# EAGLE design picoAva-Rev3 (EAGLE 6.2)
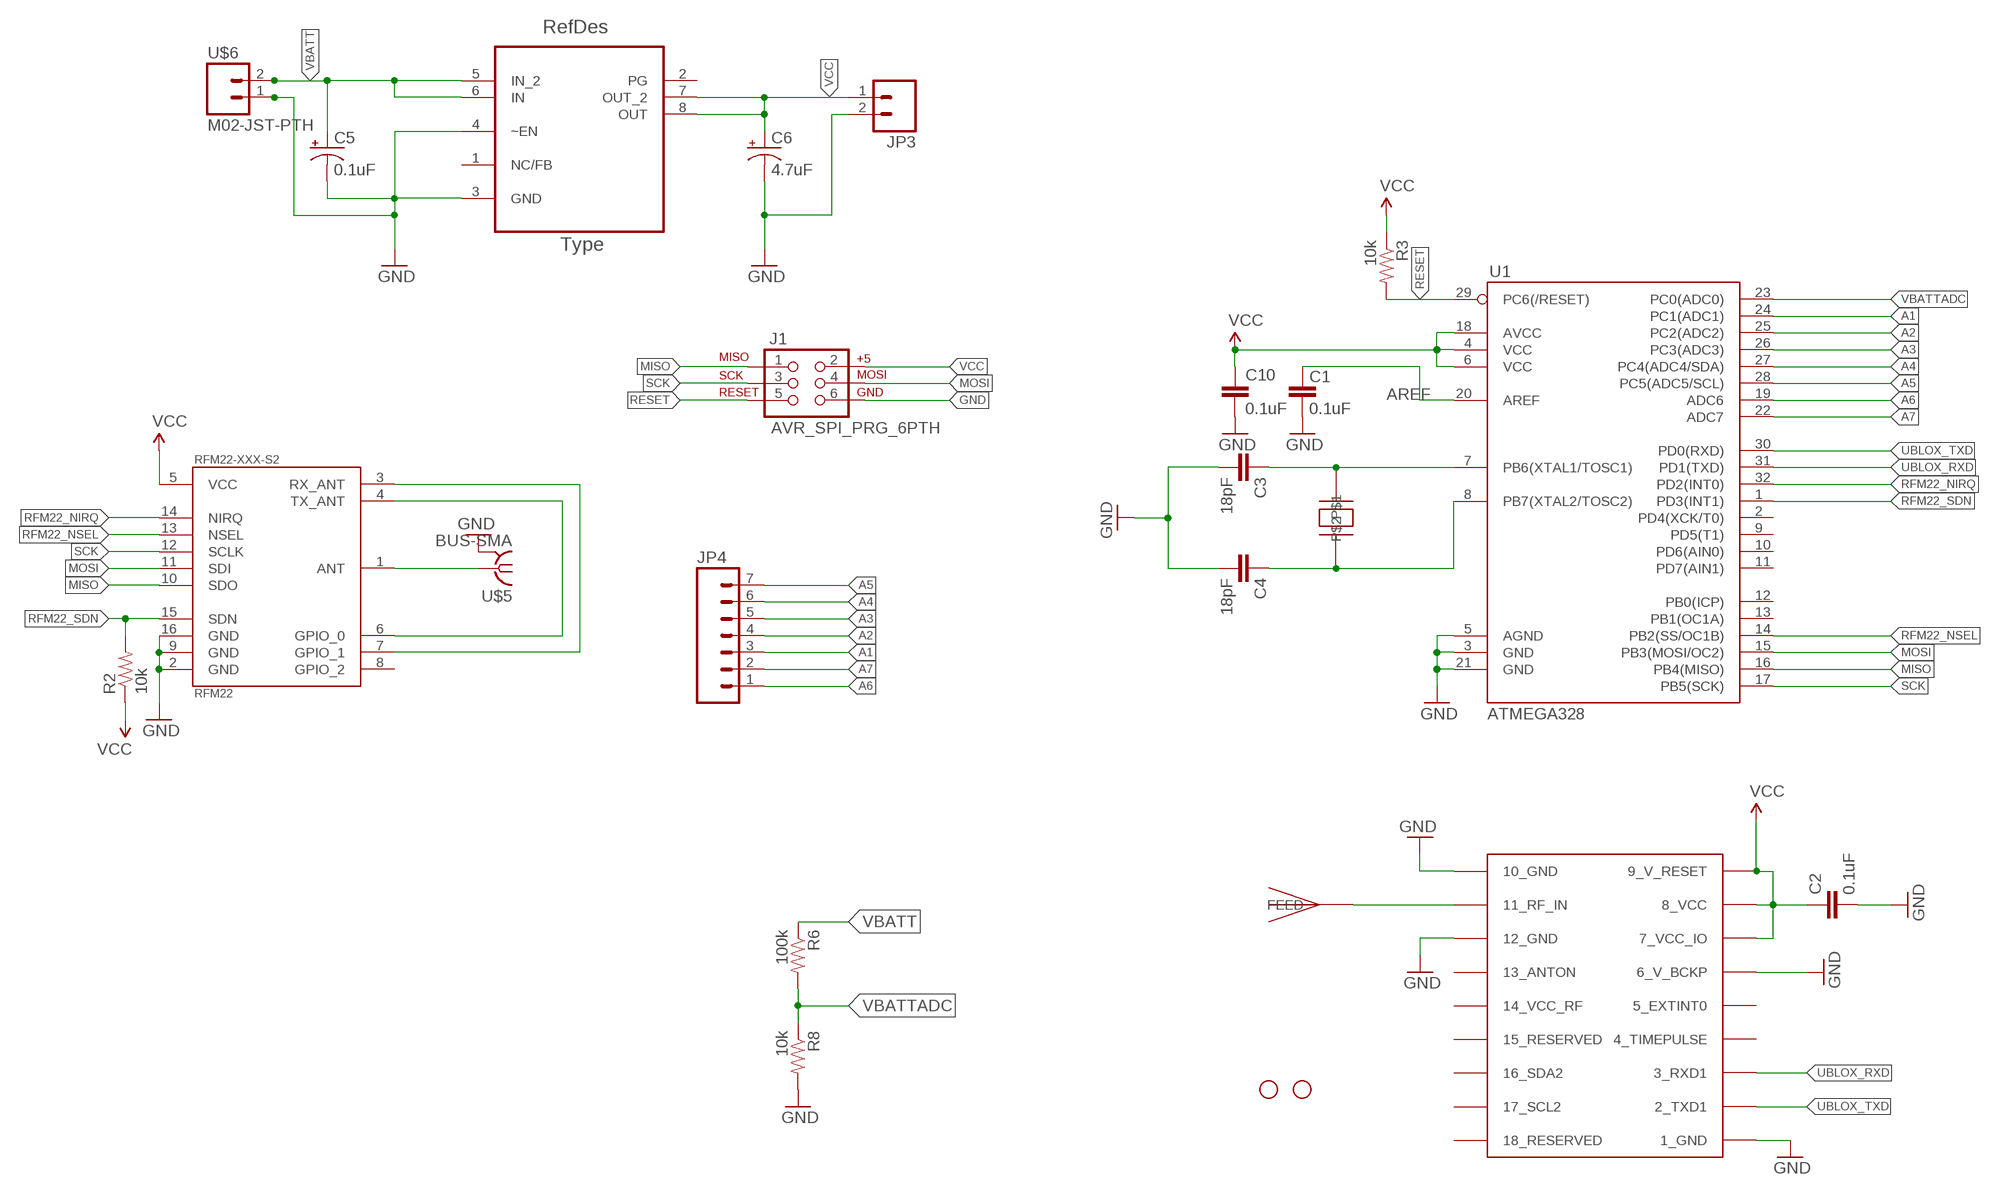
[diagram p0: schematic, sheet 1]

## Parts
C1  0.1uF  CAP0402-CAP  [0402-CAP]
C2  0.1uF  CAP0402-CAP  [0402-CAP]
C3  18pF  CAP0402-CAP  [0402-CAP]
C4  18pF  CAP0402-CAP  [0402-CAP]
C5  0.1uF  CAP_POL1206-KIT  [EIA3216-KIT]
C6  4.7uF  CAP_POL1206-KIT  [EIA3216-KIT]
C10  0.1uF  CAP0402-CAP  [0402-CAP]
J1  AVR_SPI_PRG_6PTH  [2X3]
JP1  STAND-OFF  [STAND-OFF]
JP2  STAND-OFF  [STAND-OFF]
JP3  M02PTH  [1X02]
JP4  M07  [1X07]
R2  10k  RESISTOR0402-RES  [0402-RES]
R3  10k  RESISTOR0402-RES  [0402-RES]
R6  100k  RESISTOR0402-RES  [0402-RES]
R8  10k  RESISTOR0402-RES  [0402-RES]
RFM22-XXX-S2  RFM22  [RFM22-XXX-S2]
U1  ATMEGA328  ATMEGA168  [TQFP32-08]
U2  TPS76633D  [SOIC127P600X175-8N]
U$1  UBLOX_MAX-6  [UBLOX_MAX-6]
U$2  ABRACON_ABM3_CRYSTAL  [ABRACON_ABM3_CRYSTAL]
U$3  JTI_ANTENNA-1575AT43A40  [JTI_ANTENNA-1575AT43A40]
U$5  BUS-SMA  [BUS-SMA]
U$6  M02-JST-PTH  [M02-JST-PTH]

## Nets
A1: JP4.3 U1.24(PC1(ADC1))
A2: JP4.4 U1.25(PC2(ADC2))
A3: JP4.5 U1.26(PC3(ADC3))
A4: JP4.6 U1.27(PC4(ADC4/SDA))
A5: JP4.7 U1.28(PC5(ADC5/SCL))
A6: JP4.1 U1.19(ADC6)
A7: JP4.2 U1.22(ADC7)
AREF: C1.2 U1.20(AREF)
GND [vcc]: C1.1 C2.2 C3.2 C4.2 C5.C(-) C6.C(-) C10.2 J1.6 JP3.2 R8.2 RFM22-XXX-S2.2(GND) RFM22-XXX-S2.9(GND) RFM22-XXX-S2.16(GND) U1.3(GND) U1.5(AGND) U1.21(GND) U2.3(GND) U2.4(~EN) U$1.1_GND U$1.6_V_BCKP U$1.10_GND U$1.12_GND U$5.2(GND) U$5.3(GND) U$5.4(GND) U$5.5(GND) U$6.1
MISO: J1.1 RFM22-XXX-S2.10(SDO) U1.16(PB4(MISO))
MOSI: J1.4 RFM22-XXX-S2.11(SDI) U1.15(PB3(MOSI/OC2))
N$3: RFM22-XXX-S2.1(ANT) U$5.1
N$4: U$1.11_RF_IN U$3.FEED
N$5: RFM22-XXX-S2.3(RX_ANT) RFM22-XXX-S2.7(GPIO_1)
N$6: RFM22-XXX-S2.4(TX_ANT) RFM22-XXX-S2.6(GPIO_0)
N$9: C3.1 U1.7(PB6(XTAL1/TOSC1)) U$2.P$2
N$10: C4.1 U1.8(PB7(XTAL2/TOSC2)) U$2.P$1
RESET: J1.5 R3.2 U1.29(PC6(/RESET))
RFM22_NIRQ: RFM22-XXX-S2.14(NIRQ) U1.32(PD2(INT0))
RFM22_NSEL: RFM22-XXX-S2.13(NSEL) U1.14(PB2(SS/OC1B))
RFM22_SDN: R2.2 RFM22-XXX-S2.15(SDN) U1.1(PD3(INT1))
SCK: J1.3 RFM22-XXX-S2.12(SCLK) U1.17(PB5(SCK))
UBLOX_RXD: U1.31(PD1(TXD)) U$1.3_RXD1
UBLOX_TXD: U1.30(PD0(RXD)) U$1.2_TXD1
VBATT [vcc]: C5.A(+) R6.1 U2.5(IN_2) U2.6(IN) U$6.2
VBATTADC: R6.2 R8.1 U1.23(PC0(ADC0))
VCC: C2.1 C6.A(+) C10.1 J1.2 JP3.1 R2.1 R3.1 RFM22-XXX-S2.5(VCC) U1.4(VCC) U1.6(VCC) U1.18(AVCC) U2.7(OUT_2) U2.8(OUT) U$1.7_VCC_IO U$1.8_VCC U$1.9_V_RESET
Unconnected: RFM22-XXX-S2.8(GPIO_2) U1.2(PD4(XCK/T0)) U1.9(PD5(T1)) U1.10(PD6(AIN0)) U1.11(PD7(AIN1)) U1.12(PB0(ICP)) U1.13(PB1(OC1A)) U2.1(NC/FB) U2.2(PG) U$1.4_TIMEPULSE U$1.5_EXTINT0 U$1.13_ANTON U$1.14_VCC_RF U$1.15_RESERVED U$1.16_SDA2 U$1.17_SCL2 U$1.18_RESERVED

## Library data of the parts
C1-C4 C10 = SparkFun:CAP: Capacitor Standard 0603 ceramic capacitor, and 0.1" leaded capacitor.
C5 C6 = SparkFun:CAP_POL: Capacitor Polarized These are standard SMD and PTH capacitors. Normally 10uF, 47uF, and 100uF in electrolytic and tantalum varieties. Always verify the external diameter of the through hole cap, it varies with capacity, voltage, and manufacturer. The EIA devices should be standard.
J1 = SparkFun:AVR_SPI_PRG_6: AVR ISP 6 Pin This is the reduced ISP connector for AVR programming. Common on Arduino. This footprint will take up less PCB space and can be used with a 10-pin to 6-pin adapter such as SKU: BOB-08508
JP1 JP2 = SparkFun:STAND-OFF: Stand Off This is the mechanical footprint for a #4 phillips button head screw. Use the keepout ring to avoid running the screw head into surrounding components. SKU : PRT-00447
JP3 = SparkFun:M02: Header 2 Standard 2-pin 0.1" header. Use with straight break away headers (SKU : PRT-00116), right angle break away headers (PRT-00553), swiss pins (PRT-00743), machine pins (PRT-00117), and female headers (PRT-00115). Molex polarized connector foot print use with SKU : PRT-08233 with associated crimp pins and housings.
JP4 = SparkFun:M07: Header 7 Standard 7-pin 0.1" header. Use with straight break away headers (SKU : PRT-00116), right angle break away headers (PRT-00553), swiss pins (PRT-00743), machine pins (PRT-00117), and female headers (PRT-00115). NOTES ON THE VARIANTS LOCK and LOCK_LONGPADS... This footprint was designed to help hold the alignment of a through-hole component (i.e. 7-pin header) while soldering it into place. You may notice that each hole has been shifted either up or down by 0.005 of an inch from it's more standard position (which is usually a perfectly straight line). This slight alteration caused the pins (the squares in the middle) to touch the edges of the holes. Because they are alternating, it causes a "brace" to hold the header in place. 0.005 has proven to be the perfect amount of "off-center" position when using our standard breakaway headers. Although looks a little odd when you look at the bare footprint, once you have a header in there, the alteration is very hard to notice. Also, if you push a header all the way into place, it is covered up entirely on the bottom side. This idea of altering the position of holes to aid alignment will be further integrated into the Sparkfun Library for other footprints. It can help hold any component with 3 or more connection pins.
R2 R3 R6 R8 = SparkFun:RESISTOR: Resistor Basic schematic elements and footprints for 0603, 1206, and PTH resistors.
RFM22-XXX-S2 = SparkFun:RFM22: *Hope RF's RFM22* Packages: RFM22-S2 (SMD)
U1 = SparkFun:ATMEGA168
U2 = ava:TPS76633D; DESCRIPTION: ULTRALOW QUIESCENT CURRENT 250-mA LOW DROPOUT VOLTAGE REGULATORS; MPN: TPS76633D; OC_FARNELL: 8461422; OC_NEWARK: 77C1060; PACKAGE: SOIC-8; SUPPLIER: Texas Instruments
U$1 = ava:UBLOX_MAX-6: UBLOX MAX-6
U$2 = ava:ABRACON_ABM3_CRYSTAL
U$3 = ava:JTI_ANTENNA-1575AT43A40
U$5 = ava:BUS-SMA
U$6 = ava:M02-JST-PTH

## Net classes
0 default: width 0.203 mm
1 vcc: width 0.254 mm

## Board
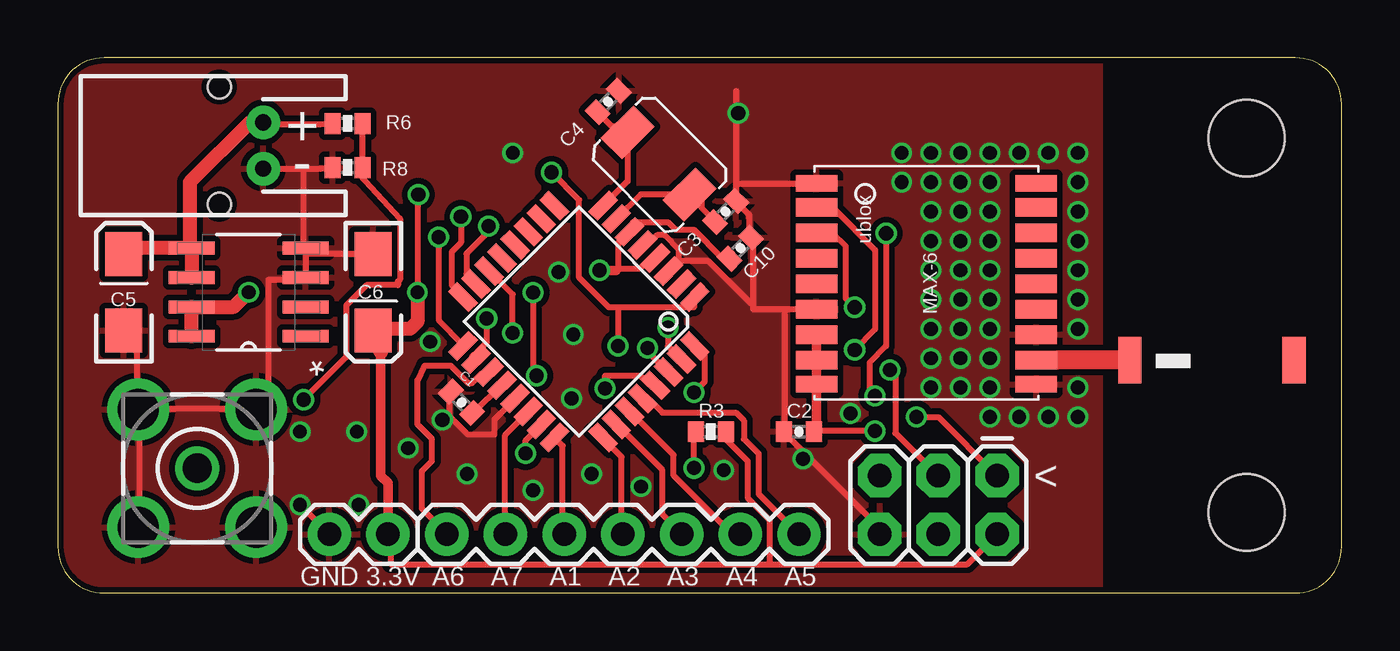
[diagram p1: board, top side]
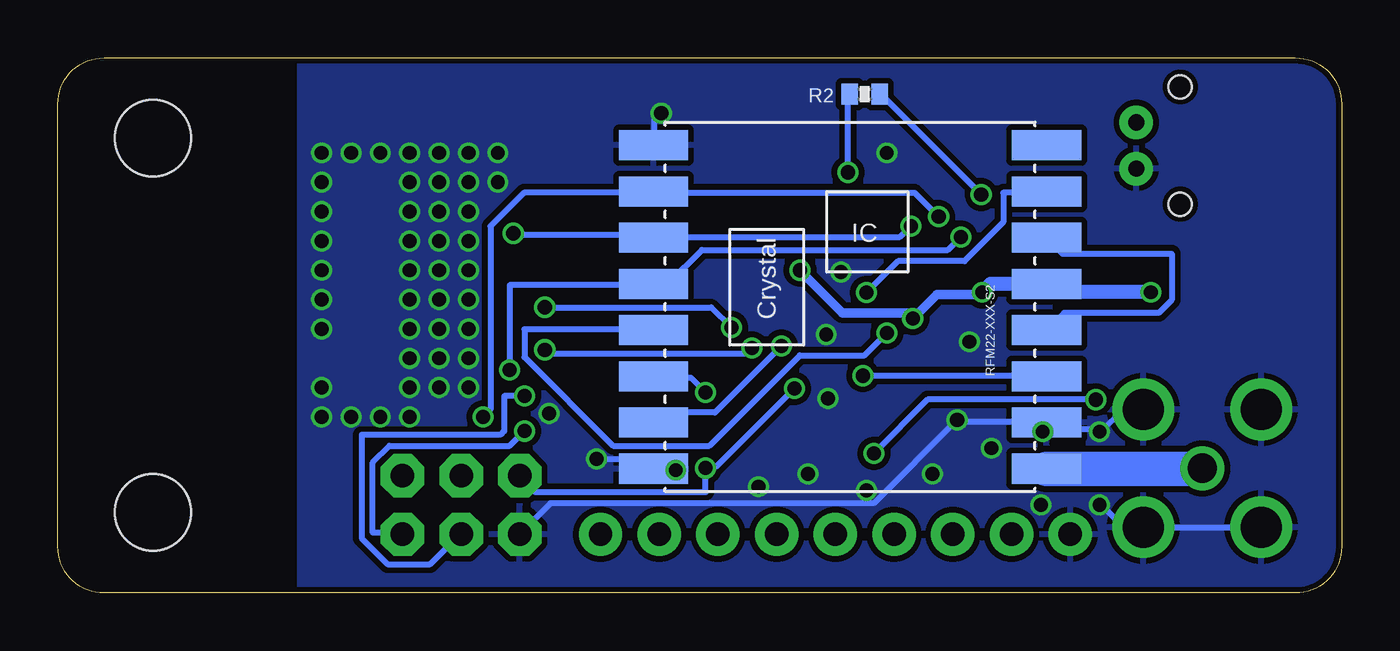
[diagram p2: board, bottom side, seen from below]

Size 55.55 x 23.17 mm. Coordinates in mm from the lower left corner, seen from the top.
Outline: 0,21.17 0,2 arc90 2,0 53.55,0 arc90 55.55,2 55.55,21.17 arc90 53.55,23.17 2,23.17 arc90 0,21.17
Copper layers (1*16): Top 0.035mm / dielectric 1.5mm / Bottom 0.035mm
Design rules: minimum track width 6mil, minimum drill 12mil, track to track 6mil, track to pad 6mil, pad to pad 6mil, via to via 6mil, smd to smd 0mil, copper to edge 10mil, drill to drill 10mil, minimum pad ring 10mil, minimum via ring 6mil, stop-mask expansion 2mil, vias tented up to drill 100mil, thermal gap 10mil

### Footprints (pad centres in the part's own frame; a part is rotated, then mirrored left to right if it is on the bottom)
0402-CAP = smd 0.7 x 0.9: 1 -0.65,0; 2 0.65,0
EIA3216-KIT = smd 1.9 x 1.6: A 1.65,0; C -1.65,0
2X3 = drill 1.016 pad 1.88 octagon: 1 0,0; 2 0,2.54; 3 2.54,0; 4 2.54,2.54; 5 5.08,0; 6 5.08,2.54
STAND-OFF = hole 3.302: 0,0
1X02 = drill 1.016 pad 1.88: 1 0,0; 2 2.54,0
1X07 = drill 1.016 pad 1.88: 1 0,0; 2 2.54,0; 3 5.08,0; 4 7.62,0; 5 10.16,0; 6 12.7,0; 7 15.24,0
0402-RES = smd 0.7 x 0.9: 1 -0.65,0; 2 0.65,0
RFM22-XXX-S2 = smd 3 x 1.3: 1 -8.5,7; 2 -8.5,5; 3 -8.5,3; 4 -8.5,1; 5 -8.5,-1; 6 -8.5,-3; 7 -8.5,-5; 8 -8.5,-7; 9 8.5,-7; 10 8.5,-5; 11 8.5,-3; 12 8.5,-1; 13 8.5,1; 14 8.5,3; 15 8.5,5; 16 8.5,7
TQFP32-08 = smd 1.27 x 0.559: 1 -4.293,2.8; 2 -4.293,2; 3 -4.293,1.2; 4 -4.293,0.4; 5 -4.293,-0.4; 6 -4.293,-1.2; 7 -4.293,-2; 8 -4.293,-2.8; 17 4.293,-2.8; 18 4.293,-2; 19 4.293,-1.2; 20 4.293,-0.4; 21 4.293,0.4; 22 4.293,1.2; 23 4.293,2; 24 4.293,2.8 | smd 0.559 x 1.27: 9 -2.8,-4.293; 10 -2,-4.293; 11 -1.2,-4.293; 12 -0.4,-4.293; 13 0.4,-4.293; 14 1.2,-4.293; 15 2,-4.293; 16 2.8,-4.293; 25 2.8,4.293; 26 2,4.293; 27 1.2,4.293; 28 0.4,4.293; 29 -0.4,4.293; 30 -1.2,4.293; 31 -2,4.293; 32 -2.8,4.293
SOIC127P600X175-8N = smd 1.981 x 0.559: 1 -2.464,1.905; 2 -2.464,0.635; 3 -2.464,-0.635; 4 -2.464,-1.905; 5 2.464,-1.905; 6 2.464,-0.635; 7 2.464,0.635; 8 2.464,1.905
UBLOX_MAX-6 = smd 1.8 x 0.7: 1_GND 4.95,-4.4; 9_V_RESET 4.95,4.3; 10_GND -4.55,4.3; 18_RESERVED -4.55,-4.4 | smd 1.8 x 0.8: 2_TXD1 4.95,-3.35; 3_RXD1 4.95,-2.25; 4_TIMEPULSE 4.95,-1.15; 5_EXTINT0 4.95,-0.05; 6_V_BCKP 4.95,1.05; 7_VCC_IO 4.95,2.15; 8_VCC 4.95,3.25; 11_RF_IN -4.55,3.25; 12_GND -4.55,2.15; 13_ANTON -4.55,1.05; 14_VCC_RF -4.55,-0.05; 15_RESERVED -4.55,-1.15; 16_SDA2 -4.55,-2.25; 17_SCL2 -4.55,-3.35
ABRACON_ABM3_CRYSTAL = smd 1.3 x 2: P$1 -3.4,0.1; P$2 0.4,0.1
JTI_ANTENNA-1575AT43A40 = smd 1 x 2: FEED -3.81,-1.27; NC 3.29,-1.27
BUS-SMA = drill 1.27: 1 0,0 | drill 1.778: 2 -2.55,2.55; 3 2.55,2.55; 4 2.55,-2.55; 5 -2.55,-2.55
M02-JST-PTH = drill 0.7 pad 1.448: 1 -1,0; 2 1,0 | hole 1: -2.54,1.905; 2.54,1.905

### Placement (x,y rotation side)
C1  17.46,8.26 315 top
C2  32.07,6.98 180 top
C3  28.89,16.51 45 top
C4  23.81,21.27 45 top
C5  2.86,13.02 90 top
C6  13.65,13.02 270 top
C10  29.53,14.92 45 top
J1  40.64,5.08 180 top
JP1  51.44,19.68 0 top
JP2  51.44,3.49 0 top
JP3  14.29,2.54 180 top
JP4  16.83,2.54 0 top
R2  20.64,21.59 180 bottom
R3  28.26,6.98 180 top
R6  12.54,20.32 0 top
R8  12.54,18.41 180 top
RFM22-XXX-S2  21.27,12.38 180 bottom
U1  22.54,11.75 225 top
U2  8.26,13.02 180 top
U$1  37.78,13.34 180 top
U$2  26.99,17.46 315 top
U$3  50.2,11.35 0 top
U$5  6.03,5.4 0 top
U$6  8.89,19.37 90 top

### Tracks (layer width: path | path; a pad name or v marks a point on that pad's centre or on a via)
A1
  Top 0.254: U1.24 21.52,6.69 21.84,6.37 21.84,2.61 JP4.3
A2
  Top 0.254: U1.25 23.6,6.69 24.4,5.89 24.4,2.61 JP4.4
A3
  Top 0.254: U1.26 24.24,7.25 26.16,5.33 26.16,3.41 26.96,2.61 JP4.5
A4
  Top 0.254: U1.27 24.8,7.81 26.64,5.97 26.64,5.09 29.12,2.61 29.52,2.61 JP4.6
A5
  Top 0.254: JP4.7 30.32,4.29 30.32,6.03 29.69,6.67 29.69,7.46 29.34,7.81 26.16,7.81 25.6,8.37 25.36,8.37 U1.28
A6
  Top 0.254: U1.19 18.64,9.49 18.32,9.49 17.92,9.09 17.76,9.09 17,9.84 15.88,9.84 15.56,9.21 15.56,7.3 16.19,6.67 16.19,5.71 15.76,5.28 15.76,3.65 16.8,2.61 JP4.1
A7
  Top 0.254: U1.22 20.32,7.81 19.36,6.85 19.36,2.61 JP4.2
AREF
  Top 0.254: C1.2 18,7.81 19.2,9.01 U1.20
GND  (via drill 0.6, 0.61)
  Top 0.254: 32.4,5.97 35.52,2.85 35.52,2.61 J1.6 | 32.4,5.97 31.44,6.93 C2.2 31.44,7.09 31.44,12.29 | v32.24,5.81 32.4,5.97 | 26.88,14.37 26.88,14.85 26.24,15.49 25.92,15.49 25.52,15.09 25.36,15.09 U1.5 | 26.88,14.37 26.48,13.97 U1.3 | 29.36,17.73 29.36,17.09 C3.2 29.36,16.93 29.92,16.37 29.92,15.41 C10.2 30.08,15.33 30.08,12.53 | 29.36,17.73 29.36,20.77 | 29.36,20.77 29.36,21.73 | 31.44,12.29 30.08,12.29 30.08,12.53 | 31.44,12.29 32.8,12.29 U$1.6_V_BCKP | 29.36,17.73 32.8,17.73 U$1.1_GND | 26.88,14.37 28.16,14.37 30,12.53 30.08,12.53 | v29.44,20.77 29.36,20.77 | JP3.2 v10.48,3.81 | C5.C 2.88,11.33 3.44,10.77 3.44,7.97 U$5.2 | U$6.1 10.64,18.37 | 10.64,18.37 11.36,18.37 R8.2 | 10.72,14.69 13.6,14.69 C6.C | 10.72,14.69 10.72,14.85 U2.4 10.64,15.01 10.64,18.37 | 10.72,14.69 10.72,13.73 U2.3 10.64,13.57 9.12,13.57 9.12,8.45 8.64,7.97 U$5.3 8.48,7.97 3.6,7.97 U$5.2 | 16.96,7.65 16.96,8.69 C1.1 | 16.96,7.65 17.76,6.85 18.88,6.85 18.88,7.49 19.76,8.37 U1.21 | v16.64,7.49 16.64,7.57 16.88,7.57 16.96,7.65 | U$5.5 3.52,2.93 3.52,7.89 U$5.2
  Bottom 0.254: v32.24,5.81 30.24,5.81 29.84,5.41 RFM22-XXX-S2.16 | v29.44,20.77 29.76,20.77 29.76,19.41 RFM22-XXX-S2.9 | v10.48,3.81 10.4,3.81 9.52,2.93 8.64,2.93 U$5.4 8.48,2.85 3.52,2.85 U$5.5 | U$5.3 8.64,7.89 9.52,7.89 10.4,7.01 v10.48,6.99 10.56,7.09 12.48,7.09 12.72,7.33 RFM22-XXX-S2.2 12.8,7.41 16.56,7.41 v16.64,7.49 20.24,3.89 34.24,3.89 35.52,2.61 J1.6
  other vias: 44.13,11.43 44.13,8.89 19.68,19.05 22.23,8.41 20.56,4.45 25.24,4.6 28.81,5.32 13.02,3.81 12.94,6.98 22.3,11.19 16.11,10.87 15.16,6.27 17.7,5.16 40.32,8.89 37.78,8.89 39.05,8.89 40.32,10.16 39.05,10.16 37.78,10.16 40.32,11.43 37.78,11.43 39.05,11.43 40.32,12.7 39.05,12.7 37.78,12.7 40.32,13.97 37.78,13.97 39.05,13.97 40.32,15.24 39.05,15.24 37.78,15.24 40.32,16.51 37.78,16.51 39.05,16.51 40.32,17.78 39.05,17.78 37.78,17.78 36.51,17.78 44.13,12.7 44.13,13.97 44.13,15.24 44.13,16.51 44.13,17.78 44.13,19.05 42.86,19.05 41.59,19.05 40.32,19.05 39.05,19.05 37.78,19.05 36.51,19.05 40.32,7.62 41.59,7.62 42.86,7.62 44.13,7.62 23.1,5.16 21.67,13.89 34.29,7.78
  pour Top (isolate 0.254): 0,23.18 45.09,23.18 45.09,0 2,0 arc-90 0,2
  pour Bottom (isolate 0.254): 0,23.18 45.09,23.18 45.09,0 2,0 arc-90 0,2
MISO  (via drill 0.6, 0.61)
  Top 0.254: v17.44,16.29 17.44,15.17 17.04,14.77 17.04,13.33 17.52,12.85 U1.16 | v37.15,7.62 38.1,7.62 J1.1
  Bottom 0.254: v17.44,16.29 18.48,17.33 29.76,17.33 | 29.76,17.33 RFM22-XXX-S2.10 | 29.76,17.33 35.38,17.33 36.83,15.87 36.83,7.94 v37.15,7.62
MOSI  (via drill 0.61)
  Top 0.254: v18.64,15.89 18.64,15.65 17.68,14.69 17.68,13.81 18.08,13.41 U1.15 | v35.36,8.53 35.12,8.77 35.12,9.97 35.84,10.69 v35.84,15.57
  Bottom 0.254: v18.64,15.89 19.12,15.41 29.76,15.41 RFM22-XXX-S2.11 29.84,15.49 35.76,15.49 v35.84,15.57 | v35.36,8.53 36.24,8.53 36.24,7.01 36.4,6.85 42.4,6.85 42.4,2.37 41.28,1.25 39.44,1.25 38.16,2.53 J1.4
N$3
  Bottom 0.813: 6.03,5.38 U$5.1
  Bottom 1.5: RFM22-XXX-S2.1 6.03,5.38
N$4
  Top 0.254: 43.21,10.08 42.97,10.08 U$1.11_RF_IN
  Top 0.813: U$3.FEED 43.21,10.08
N$5  (via drill 0.61)
  Top 0.254: v20.72,9.41 20.56,9.57 v20.56,13.01
  Bottom 0.254: v20.72,9.41 12.8,9.41 RFM22-XXX-S2.3 | v20.56,13.01 19.2,14.37 16.32,14.37 14.64,16.05 14.64,17.33 12.8,17.33 RFM22-XXX-S2.7
N$6
  Bottom 0.254: RFM22-XXX-S2.4 12.72,11.41 12,12.13 7.92,12.13 7.36,12.69 7.36,14.69 12.08,14.69 12.72,15.33 RFM22-XXX-S2.6
N$9
  Top 0.254: U$2.P$2 25.22,17.25 U1.7 | U$2.P$2 27.8,17.25 | C3.1 28.4,16.13 27.84,16.69 27.84,17.17 U$2.P$2
N$10
  Top 0.254: U$2.P$1 24.65,17.82 U1.8 | 24.56,19.57 U$2.P$1 | U$2.P$1 24.41,20.18 23.99,20.18 C4.1
RESET  (via drill 0.61)
  Top 0.254: v27.52,5.41 27.52,6.85 27.6,6.93 R3.2 | v23.68,8.85 23.68,9.41 25.2,9.41 25.6,9.01 25.84,9.01 U1.29
  Bottom 0.254: J1.5 35.52,5.01 34.88,4.37 27.52,4.37 v27.52,5.41 27.44,5.49 27.04,5.49 v23.68,8.85
RFM22_NIRQ  (via drill 0.61)
  Top 0.254: v27.52,8.69 28,9.17 28,10.29 27.6,10.69 U1.32
  Bottom 0.254: v27.52,8.69 28.16,9.33 29.76,9.33 RFM22-XXX-S2.14
RFM22_NSEL  (via drill 0.61)
  Top 0.254: v19.68,11.25 19.68,12.93 18.72,13.89 U1.14
  Bottom 0.254: v19.68,11.25 20.64,10.29 23.44,10.29 27.36,6.37 31.52,6.37 35.36,10.21 35.36,11.41 29.84,11.41 RFM22-XXX-S2.13
RFM22_SDN  (via drill 0.61)
  Top 0.254: v21.36,18.21 22.56,17.01 22.56,13.65 23.84,12.37 24.24,12.37 | 24.24,12.37 27.52,12.37 27.52,12.77 U1.1 | 24.24,12.37 v24.24,10.69
  Bottom 0.254: v21.36,18.21 21.36,21.57 R2.2 | v24.24,10.69 27.12,7.81 29.36,7.81 29.76,7.41 RFM22-XXX-S2.15
SCK  (via drill 0.61)
  Top 0.254: v16.48,15.41 16.48,11.81 17.52,10.77 U1.17 | v36,9.65 36.24,9.41 36.24,6.93 38.08,5.09 J1.3
  Bottom 0.254: v16.48,15.41 17.04,14.85 27.68,14.85 29.12,13.41 29.76,13.41 RFM22-XXX-S2.12 29.84,13.33 36,13.33 v36,9.65
UBLOX_RXD  (via drill 0.61)
  Top 0.254: v26.4,11.49 26.4,10.69 26.96,10.13 U1.31 | v34.48,12.37 34.08,12.77 34.08,15.01 33.52,15.57 32.88,15.57 U$1.3_RXD1
  Bottom 0.254: v26.4,11.49 27.28,12.37 v34.48,12.37
UBLOX_TXD  (via drill 0.61)
  Top 0.254: v25.52,10.61 25.52,10.45 26.4,9.57 U1.30 | v34.48,10.53 35.36,11.41 35.36,14.85 33.6,16.61 32.88,16.61 U$1.2_TXD1
  Bottom 0.254: v25.52,10.61 25.76,10.37 34.32,10.37 v34.48,10.53
VBATT
  Top 0.254: R6.1 11.36,20.29 9.12,20.29 U$6.2
  Top 0.61: U$6.2 8.3,20.37 5.71,17.78 5.71,15 U2.5 | U2.5 U2.6 | U2.5 3.11,14.92 C5.A
VBATTADC  (via drill 0.61)
  Top 0.254: v20.24,6.05 20.24,6.61 20.88,7.25 U1.23 | v10.64,8.37 12.48,10.21 12.48,12.45 13.36,13.33 14.72,13.33 14.72,13.49 14.8,13.57 14.8,16.21 13.04,18.13 R8.1 R6.2
  Bottom 0.254: v20.24,6.05 17.92,8.37 v10.64,8.37
VCC  (via drill 0.6, 0.61)
  Top 0.254: v35.36,7.01 32.96,7.01 C2.1 | C10.1 29.04,14.53 28.72,14.53 27.52,15.73 26.72,15.73 26.4,16.05 24.88,16.05 24.88,15.73 24.8,15.65 U1.6 24.64,15.57 24.24,15.17 24.24,14.05 | 24.24,14.05 25.2,14.05 25.52,14.37 25.68,14.37 U1.4 | v15.6,17.25 15.6,13.25 v15.56,13.02 | v18.56,11.89 18.56,10.85 18.16,10.45 U1.18 | 24.16,13.97 24.24,14.05 | 30.8,1.25 14.4,1.25 14.4,2.29 JP3.1 | 30.8,1.25 39.36,1.25 J1.2 | R3.1 28.91,6.65 29.84,5.71 29.84,4.13 30.8,3.18 30.8,1.25
  Top 0.406: U1.4 25.86,14.43 | C2.1 32.83,7.1 U$1.9_V_RESET U$1.8_VCC U$1.7_VCC_IO | v23.44,13.97 24.16,13.97 | JP3.1 14.29,4.76 13.97,5.08 13.97,10.42
  Top 0.61: U2.8 U2.7 7.62,12.38 v8.26,13.02 | v15.56,13.02 15.56,11.75 15.24,11.43 13.71,11.43 C6.A 13.97,10.42 | U1.18 18.09,10.16
  Bottom 0.254: v35.36,7.01 36,6.37 41.2,6.37 41.92,5.65 41.92,2.61 40.64,2.61 J1.2 | v15.6,17.25 19.92,21.57 R2.1 | 15.84,12.93 v15.56,13.02 | 18.48,12.13 v18.56,11.89
  Bottom 0.406: v18.56,11.89 17.52,12.93 15.84,12.93 | v23.44,13.97 21.6,12.13 18.48,12.13
  Bottom 0.61: v8.26,13.02 12.41,13.02 RFM22-XXX-S2.5 15.19,13.38 v15.56,13.02

### Text on the board
tPlace: + | - | < | GND | 3.3V | A6 | A7 | A1 | A2 | A3 | A4 | A5
tStop: µAvaRFM-Rev2 | M0UPU 2012